# EAGLE design EffectsBox (EAGLE 7.6.0)
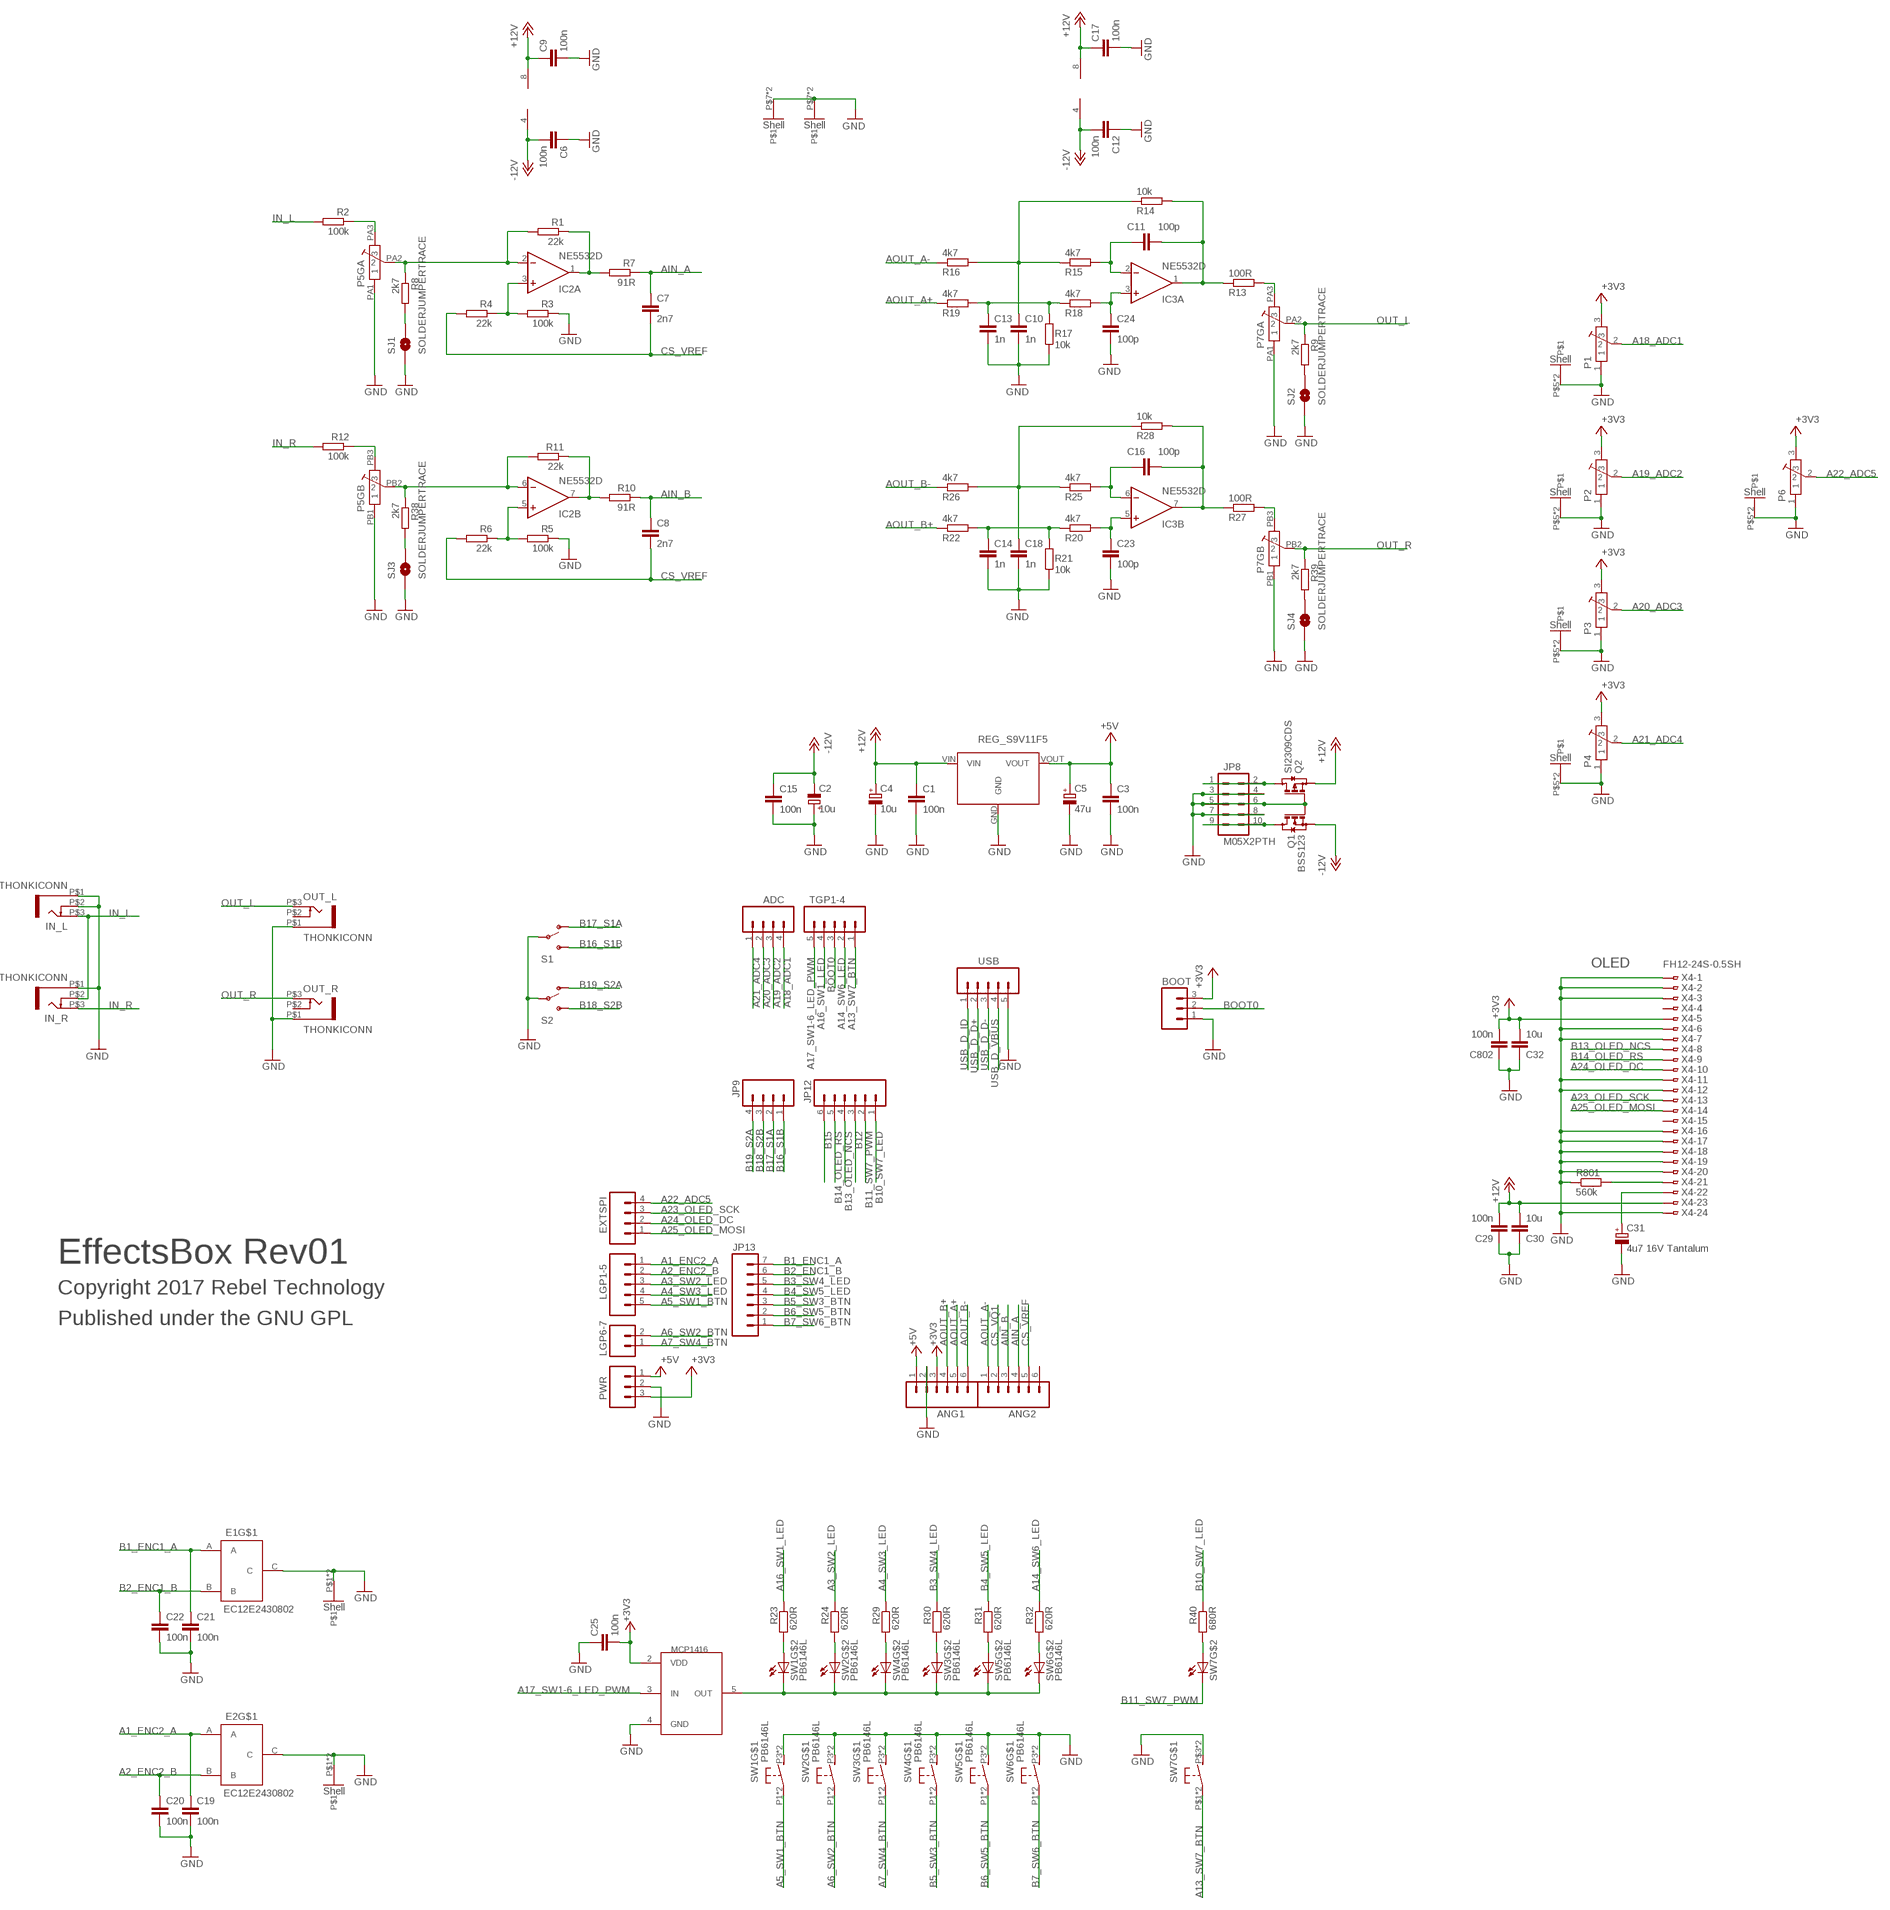
[diagram p0: schematic, sheet 1]

## Parts
ADC  M04PTH  [1X04]
ANG1  M06SIP  [1X06]
ANG2  M06SIP  [1X06]
BOOT  M03PTH  [1X03]
C1  100n  C-EUC0603  [C0603]
C2  10u  CPOL-EU153CLV-0505  [CPOL-5]
C3  100n  C-EUC0603  [C0603]
C4  10u  CPOL-EU153CLV-0505  [CPOL-5]
C5  47u  CPOL-EUC  [PANASONIC_C]
C6  100n  C-EUC0603  [C0603]
C7  2n7  C-EUC0603  [C0603]
C8  2n7  C-EUC0603  [C0603]
C9  100n  C-EUC0603  [C0603]
C10  1n  C-EUC0603  [C0603]
C11  100p  C-EUC0603  [C0603]
C12  100n  C-EUC0603  [C0603]
C13  1n  C-EUC0603  [C0603]
C14  1n  C-EUC0603  [C0603]
C15  100n  C-EUC0603  [C0603]
C16  100p  C-EUC0603  [C0603]
C17  100n  C-EUC0603  [C0603]
C18  1n  C-EUC0603  [C0603]
C19  100n  C-EUC0603  [C0603]
C20  100n  C-EUC0603  [C0603]
C21  100n  C-EUC0603  [C0603]
C22  100n  C-EUC0603  [C0603]
C23  100p  C-EUC0603  [C0603]
C24  100p  C-EUC0603  [C0603]
C25  100n  C-EUC0603  [C0603]
C29  100n  C-EUC0603  [C0603]
C30  10u  C-EUC1206  [C1206]
C31  4u7 16V Tantalum  CPOL-EUSMCA  [SMC_A]
C32  10u  C-EUC1206  [C1206]
C802  100n  C-EUC0603  [C0603]
E1  EC12E2430802  [EC12E2430802]
E2  EC12E2430802  [EC12E2430802]
EXTSPI  M04PTH  [1X04]
IC2  NE5532D  [SO08]
IC3  NE5532D  [SO08]
IN_L  THONKICONN  [THONKICONN]
IN_R  THONKICONN  [THONKICONN]
JP8  M05X2PTH  [AVR_ICSP]
JP9  M04PTH  [1X04]
JP12  M06SIP  [1X06]
JP13  M07  [1X07]
LGP1-5  M05PTH  [1X05]
LGP6-7  M02PTH  [1X02]
OUT_L  THONKICONN  [THONKICONN]
OUT_R  THONKICONN  [THONKICONN]
P1  POT-ALPS-RK09L1140  [POT-ALPS-RK09L1140]
P2  POT-ALPS-RK09L1140  [POT-ALPS-RK09L1140]
P3  POT-ALPS-RK09L1140  [POT-ALPS-RK09L1140]
P4  POT-ALPS-RK09L1140  [POT-ALPS-RK09L1140]
P5  POT-ALPS_RK09L12D0A1W  [POT-ALPS-RK09L12D0A1W]
P6  POT-ALPS-RK09L1140  [POT-ALPS-RK09L1140]
P7  POT-ALPS_RK09L12D0A1W  [POT-ALPS-RK09L12D0A1W]
PWR  M03PTH  [1X03]
Q1  BSS123  [SOT23]
Q2  SI2309CDS  BSS84  [SOT23]
R1  22k  R-EU_0603  [0603]
R2  100k  R-EU_0603  [0603]
R3  100k  R-EU_0603  [0603]
R4  22k  R-EU_0603  [0603]
R5  100k  R-EU_0603  [0603]
R6  22k  R-EU_0603  [0603]
R7  91R  R-EU_0603  [0603]
R8  2k7  R-EU_R0603  [R0603]
R9  2k7  R-EU_R0603  [R0603]
R10  91R  R-EU_0603  [0603]
R11  22k  R-EU_0603  [0603]
R12  100k  R-EU_0603  [0603]
R13  100R  R-EU_0603  [0603]
R14  10k  R-EU_0603  [0603]
R15  4k7  R-EU_0603  [0603]
R16  4k7  R-EU_0603  [0603]
R17  10k  R-EU_0603  [0603]
R18  4k7  R-EU_0603  [0603]
R19  4k7  R-EU_0603  [0603]
R20  4k7  R-EU_0603  [0603]
R21  10k  R-EU_0603  [0603]
R22  4k7  R-EU_0603  [0603]
R23  620R  R-EU_0603  [0603]
R24  620R  R-EU_0603  [0603]
R25  4k7  R-EU_0603  [0603]
R26  4k7  R-EU_0603  [0603]
R27  100R  R-EU_0603  [0603]
R28  10k  R-EU_0603  [0603]
R29  620R  R-EU_0603  [0603]
R30  620R  R-EU_0603  [0603]
R31  620R  R-EU_0603  [0603]
R32  620R  R-EU_0603  [0603]
R38  2k7  R-EU_R0603  [R0603]
R39  2k7  R-EU_R0603  [R0603]
R40  680R  R-EU_0603  [0603]
R801  560k  R-EU_0603  [0603]
S1  SWITCH-SPST  [SWITCH-SPDT-SALECOM-T8014]
S2  SWITCH-SPST  [SWITCH-SPDT-SALECOM-T8014]
SJ1  SOLDERJUMPERTRACE  [SJ_2S-TRACE]
SJ2  SOLDERJUMPERTRACE  [SJ_2S-TRACE]
SJ3  SOLDERJUMPERTRACE  [SJ_2S-TRACE]
SJ4  SOLDERJUMPERTRACE  [SJ_2S-TRACE]
SW1  PB6146L  [PB6146L]
SW2  PB6146L  [PB6146L]
SW3  PB6146L  [PB6146L]
SW4  PB6146L  [PB6146L]
SW5  PB6146L  [PB6146L]
SW6  PB6146L  [PB6146L]
SW7  KS01-BL  [KS01-BL]
TGP1-4  M05PTH  [1X05]
U1  REG_S9V11F5  [REG_S9V11F5]
U2  MCP1416  [SOT23-5]
USB  M05PTH  [1X05]
X4  FH12-24S-0.5SH  [FH12-24S-0.5SH]

## Nets
+3V3: ANG1.3 BOOT.3 C25.2 C32.2 C802.2 P1.3 P2.3 P3.3 P4.3 P6.3 PWR.3 U2.2(VDD) X4.5
+5V: ANG1.1 C3.1 C5.+ PWR.1 U1.VOUT
+12V: C1.1 C4.+ C9.1 C17.1 C29.2 C30.2 IC2.8(P:V+) IC3.8(P:V+) Q2.2(S) U1.VIN X4.23
-12V: C2.- C6.2 C12.2 C15.1 IC2.4(P:V-) IC3.4(P:V-) Q1.2(S)
A1_ENC2_A: C19.1 E2.A LGP1-5.1
A2_ENC2_B: C20.1 E2.B LGP1-5.2
A3_SW2_LED: LGP1-5.3 R24.1
A4_SW3_LED: LGP1-5.4 R29.1
A5_SW1_BTN: LGP1-5.5 SW1.P1(P) SW1.P2(P)
A6_SW2_BTN: LGP6-7.2 SW2.P1(P) SW2.P2(P)
A7_SW4_BTN: LGP6-7.1 SW3.P1(P) SW3.P2(P)
A13_SW7_BTN: SW7.P$1(P) SW7.P$2(P) TGP1-4.1
A14_SW6_LED: R32.1 TGP1-4.2
A16_SW1_LED: R23.1 TGP1-4.4
A17_SW1-6_LED_PWM: TGP1-4.5 U2.3(IN)
A18_ADC1: ADC.4 P1.2
A19_ADC2: ADC.3 P2.2
A20_ADC3: ADC.2 P3.2
A21_ADC4: ADC.1 P4.2
A22_ADC5: EXTSPI.4 P6.2
A23_OLED_SCK: EXTSPI.3 X4.13
A24_OLED_DC: EXTSPI.2 X4.10
A25_OLED_MOSI: EXTSPI.1 X4.14
AIN_A: ANG2.4 C7.1 R7.1
AIN_B: ANG2.3 C8.1 R10.1
AOUT_A+: ANG1.5 R19.1
AOUT_A-: ANG2.1 R16.1
AOUT_B+: ANG1.4 R22.1
AOUT_B-: ANG1.6 R26.1
B1_ENC1_A: C21.1 E1.A JP13.7
B2_ENC1_B: C22.1 E1.B JP13.6
B3_SW4_LED: JP13.5 R30.1
B4_SW5_LED: JP13.4 R31.1
B5_SW3_BTN: JP13.3 SW4.P1(P) SW4.P2(P)
B6_SW5_BTN: JP13.2 SW5.P1(P) SW5.P2(P)
B7_SW6_BTN: JP13.1 SW6.P1(P) SW6.P2(P)
B10_SW7_LED: JP12.1 R40.1
B11_SW7_PWM: JP12.2 SW7.P$C(C)
B12: JP12.3
B13_OLED_NCS: JP12.4 X4.8
B14_OLED_RS: JP12.5 X4.9
B15: JP12.6
B16_S1B: JP9.1 S1.3(S)
B17_S1A: JP9.2 S1.1(O)
B18_S2B: JP9.3 S2.3(S)
B19_S2A: JP9.4 S2.1(O)
BOOT0: BOOT.2 TGP1-4.3
CS_VQ1: ANG2.2
CS_VREF: ANG2.5 C7.2 C8.2 R4.2 R6.2
GND: ANG1.2 BOOT.1 C1.2 C2.+ C3.2 C4.- C5.- C6.1 C9.2 C10.2 C12.1 C13.2 C14.2 C15.2 C17.2 C18.2 C19.2 C20.2 C21.2 C22.2 C23.1 C24.1 C25.1 C29.1 C30.1 C31.- C32.1 C802.1 E1.C E1.P$1 E1.P$2 E2.C E2.P$1 E2.P$2 IN_L.P$1 IN_L.P$2 IN_R.P$1 JP8.3 JP8.4 JP8.5 JP8.6 JP8.7 JP8.8 OUT_L.P$1 OUT_R.P$1 P1.1 P1.P$5 P1.P$6 P2.1 P2.P$5 P2.P$6 P3.1 P3.P$5 P3.P$6 P4.1 P4.P$5 P4.P$6 P5.P$7 P5.P$8 P5.PA1 P5.PB1 P6.1 P6.P$5 P6.P$6 P7.P$7 P7.P$8 P7.PA1 P7.PB1 PWR.2 Q1.1(G) Q2.1(G) R3.1 R5.1 R17.1 R21.1 R801.1 S1.2(P) S2.2(P) SJ1.1 SJ2.1 SJ3.1 SJ4.1 SW1.P3(S) SW1.P4(S) SW2.P3(S) SW2.P4(S) SW3.P3(S) SW3.P4(S) SW4.P3(S) SW4.P4(S) SW5.P3(S) SW5.P4(S) SW6.P3(S) SW6.P4(S) SW7.P$3(S) SW7.P$4(S) U1.GND U2.4(GND) USB.5 X4.1 X4.2 X4.3 X4.6 X4.7 X4.11 X4.12 X4.16 X4.17 X4.18 X4.19 X4.20 X4.24
IN_L: IN_L.P$3 IN_R.P$2 R2.2
IN_R: IN_R.P$3 R12.2
N$1: IC2.1(A:OUT) R1.1 R7.2
N$2: IC2.3(A:+IN) R3.2 R4.1
N$3: P5.PA3 R2.1
N$4: IC2.5(B:+IN) R5.2 R6.1
N$5: C31.+ X4.22
N$6: P7.PA3 R13.2
N$7: C11.1 IC3.2(A:-IN) R15.2
N$8: JP8.9 JP8.10 Q1.3(D)
N$9: IC2.2(A:-IN) P5.PA2 R1.2 R8.1
N$10: IC2.7(B:OUT) R10.2 R11.1
N$11: C24.2 IC3.3(A:+IN) R18.2
N$12: JP8.1 JP8.2 Q2.3(D)
N$13: R9.2 SJ2.2
N$14: SW1.PL2(C) SW2.PL2(C) SW3.PL2(C) SW4.PL2(C) SW5.PL2(C) SW6.PL2(C) U2.5(OUT)
N$15: C13.1 R17.2 R18.1 R19.2
N$16: R23.2 SW1.PL1(A)
N$17: R8.2 SJ1.2
N$18: C16.2 IC3.7(B:OUT) R27.1 R28.2
N$19: R24.2 SW2.PL1(A)
N$20: R29.2 SW4.PL1(A)
N$21: R30.2 SW3.PL1(A)
N$22: R31.2 SW5.PL1(A)
N$23: R32.2 SW6.PL1(A)
N$24: C18.1 R25.1 R26.2 R28.1
N$25: R801.2 X4.21
N$26: C16.1 IC3.6(B:-IN) R25.2
N$30: C23.2 IC3.5(B:+IN) R20.2
N$31: IC2.6(B:-IN) P5.PB2 R11.2 R38.1
N$32: C14.1 R20.1 R21.2 R22.2
N$33: P5.PB3 R12.1
N$34: R38.2 SJ3.2
N$35: P7.PB3 R27.2
N$36: R39.2 SJ4.2
N$39: C11.2 IC3.1(A:OUT) R13.1 R14.2
N$41: C10.1 R14.1 R15.1 R16.2
OUT_L: OUT_L.P$3 P7.PA2 R9.1
OUT_R: OUT_R.P$3 P7.PB2 R39.1
SW6_LED: R40.2 SW7.P$A(A)
USB_D_D+: USB.2
USB_D_D-: USB.3
USB_D_ID: USB.1
USB_D_VBUS: USB.4
Unconnected: ANG2.6 OUT_L.P$2 OUT_R.P$2 X4.4 X4.15

## Notes on the sheet
- OLED
- EffectsBox Rev01
- Copyright 2017 Rebel Technology
- Published under the GNU GPL

## Library data of the parts
ADC EXTSPI JP9 = SparkFun:M04: Header 4 Standard 4-pin 0.1" header. Use with straight break away headers (SKU : PRT-00116), right angle break away headers (PRT-00553), swiss pins (PRT-00743), machine pins (PRT-00117), and female headers (PRT-00115). Molex polarized connector foot print use with SKU : PRT-08231 with associated crimp pins and housings. 1MM SMD Version SKU: PRT-10208
ANG1 ANG2 JP12 = SparkFun:M06: Header 6 Standard 6-pin 0.1" header. Use with straight break away headers (SKU : PRT-00116), right angle break away headers (PRT-00553), swiss pins (PRT-00743), machine pins (PRT-00117), and female headers (PRT-00115). Molex polarized connector foot print use with SKU : PRT-08094 with associated crimp pins and housings. NOTES ON THE VARIANTS LOCK and LOCK_LONGPADS... This footprint was designed to help hold the alignment of a through-hole component (i.e. 6-pin header) while soldering it into place. You may notice that each hole has been shifted either up or down by 0.005 of an inch from it's more standard position (which is a perfectly straight line). This slight alteration caused the pins (the squares in the middle) to touch the edges of the holes. Because they are alternating, it causes a "brace" to hold the component in place. 0.005 has proven to be the perfect amount of "off-center" position when using our standard breakaway headers. Although looks a little odd when you look at the bare footprint, once you have a header in there, the alteration is very hard to notice. Also, if you push a header all the way into place, it is covered up entirely on the bottom side. This idea of altering the position of holes to aid alignment will be further integrated into the Sparkfun Library for other footprints. It can help hold any component with 3 or more connection pins.
BOOT PWR = SparkFun:M03: Header 3 Standard 3-pin 0.1" header. Use with straight break away headers (SKU : PRT-00116), right angle break away headers (PRT-00553), swiss pins (PRT-00743), machine pins (PRT-00117), and female headers (PRT-00115). Molex polarized connector foot print use with SKU : PRT-08232 with associated crimp pins and housings.
C1 C3 C15 C19-C22 C25 C29 C30 C32 C802 = Rebel:C-EU: CAPACITOR, European symbol
C2 C4 C31 = Rebel:CPOL-EU: POLARIZED CAPACITOR, European symbol
C5 = rcl:CPOL-EU: POLARIZED CAPACITOR, European symbol
C6-C14 C16-C18 C23 C24 = resistor:C-EU: CAPACITOR, European symbol
E1 E2 = Rebel:EC12E2430802: EC12E2430802 rotary encoder without a switch
IC2 IC3 = linear:NE5532: AUDIO AMPLIFIER
IN_L IN_R OUT_L OUT_R = Rebel:THONKICONN
JP8 = SparkFun:M05X2: Header 5x2 Standard 10-pin dual row 0.1" header. Commonly used with AVR-ISP. Use with Spark Fun Electronics SKU: PRT-00778
JP13 = SparkFun:M07: Header 7 Standard 7-pin 0.1" header. Use with straight break away headers (SKU : PRT-00116), right angle break away headers (PRT-00553), swiss pins (PRT-00743), machine pins (PRT-00117), and female headers (PRT-00115). NOTES ON THE VARIANTS LOCK and LOCK_LONGPADS... This footprint was designed to help hold the alignment of a through-hole component (i.e. 7-pin header) while soldering it into place. You may notice that each hole has been shifted either up or down by 0.005 of an inch from it's more standard position (which is usually a perfectly straight line). This slight alteration caused the pins (the squares in the middle) to touch the edges of the holes. Because they are alternating, it causes a "brace" to hold the header in place. 0.005 has proven to be the perfect amount of "off-center" position when using our standard breakaway headers. Although looks a little odd when you look at the bare footprint, once you have a header in there, the alteration is very hard to notice. Also, if you push a header all the way into place, it is covered up entirely on the bottom side. This idea of altering the position of holes to aid alignment will be further integrated into the Sparkfun Library for other footprints. It can help hold any component with 3 or more connection pins.
LGP1-5 TGP1-4 USB = SparkFun:M05: Header 5 Standard 5-pin 0.1" header. Use with straight break away headers (SKU : PRT-00116), right angle break away headers (PRT-00553), swiss pins (PRT-00743), machine pins (PRT-00117), and female headers (PRT-00115). Molex polarized connector foot print use with SKU : PRT-08230 with associated crimp pins and housings.
LGP6-7 = SparkFun:M02: Header 2 Standard 2-pin 0.1" header. Use with straight break away headers (SKU : PRT-00116), right angle break away headers (PRT-00553), swiss pins (PRT-00743), machine pins (PRT-00117), and female headers (PRT-00115). Molex polarized connector foot print use with SKU : PRT-08233 with associated crimp pins and housings.
P1-P4 P6 = Rebel:POT-ALPS-RK09L
P5 P7 = Rebel:POT-ALPS_RK09L12D0A1W
Q1 = transistor-small-signal:BSS123: N-CHANNEL MOS FET; OC_FARNELL: 1843725
Q2 = transistor-small-signal:BSS84: P-CHANNEL MOS FET; OC_FARNELL: 1779264
R1-R7 R10-R32 R40 R801 = Rebel:R-EU_: RESISTOR, European symbol
R8 R9 R38 R39 = resistor:R-EU_: RESISTOR, European symbol
S1 S2 = Rebel:SWITCH-SPST: SPST Switch Simple slide switch. Spark Fun Electronics SKU : COM-00102
SJ1-SJ4 = SparkFun:SOLDERJUMPER: Solder Jumper Standard SMD solder jumper. Used to automate production. Two varients : Normally Open and Normally Closed are the same, but have different paste layers. NC will have a large amount of paste and should jumper during reflow.
SW1-SW6 = Rebel:PB6146L
SW7 = Rebel:KS01-BL: Tactile illuminated pushbutton
U1 = Rebel:REG_S9V11F5
U2 = Rebel:MCP1416
X4 = con-hirose:FH12-24S-0.5S: 0.5mm Pitch Connectors For FPC/FFC Source: Data sheet <http://www.hirose.co.jp/cataloge_hp/e58605370.pdf>; MPN: FH12-24S-0.5SH(55); OC_FARNELL: 1324552; OC_NEWARK: 34M6170

## Net classes
1 power: width 0.178 mm, drill 0.305 mm, clearance 0.178 mm to class 0, clearance 0.178 mm

## Board
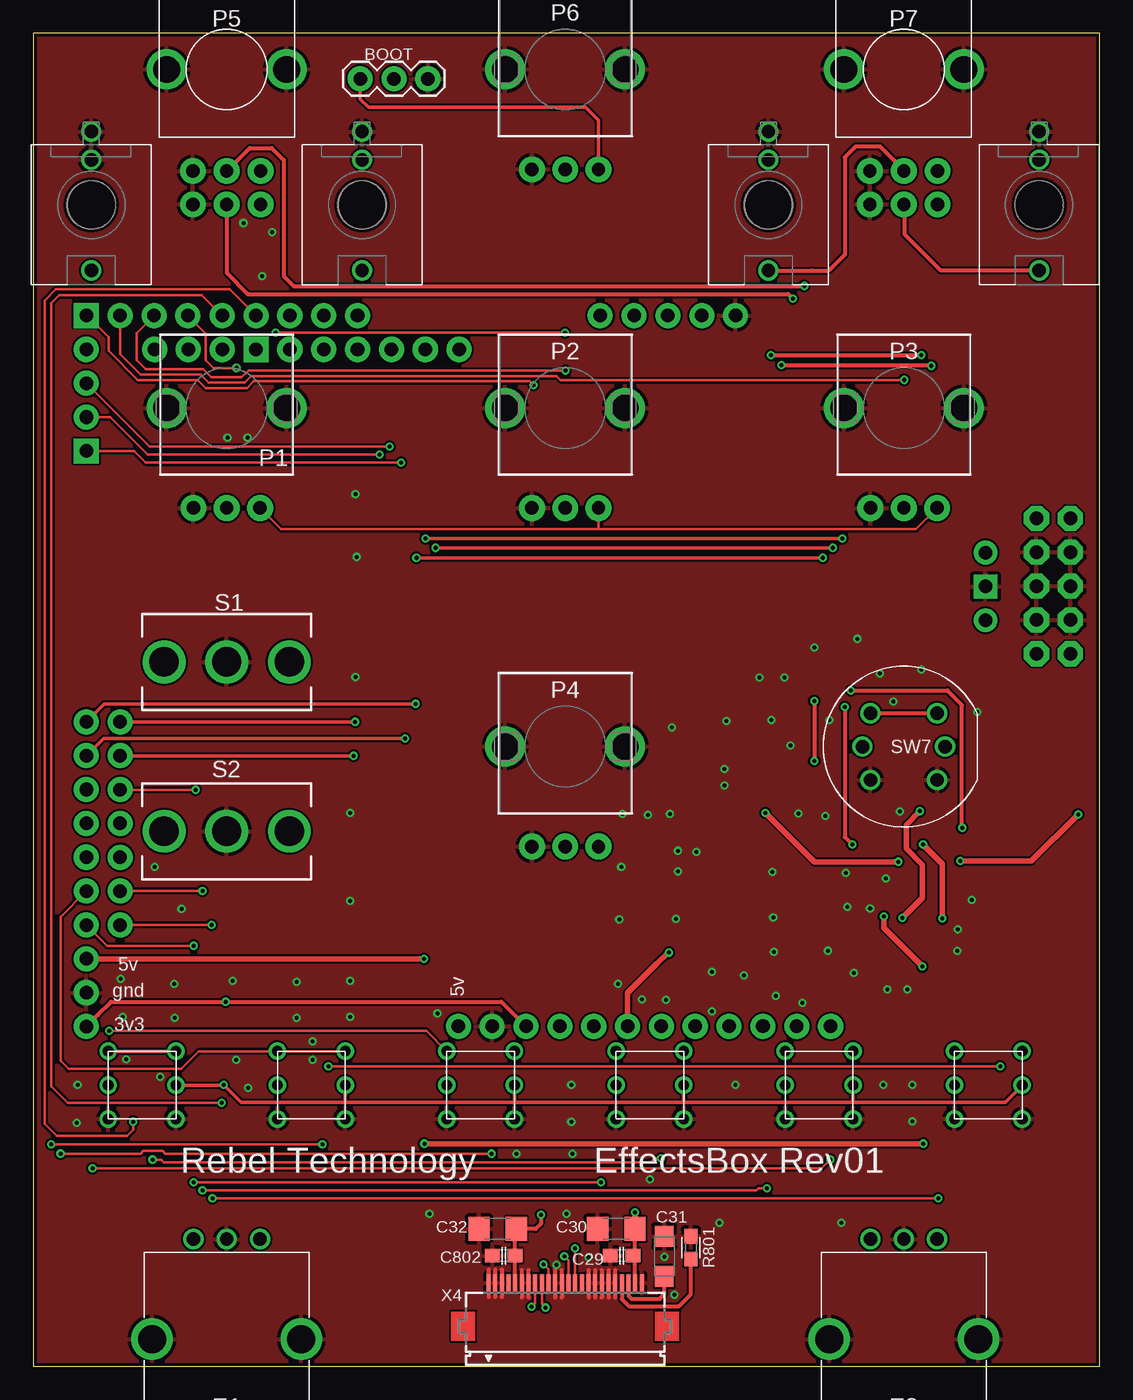
[diagram p1: board, top side]
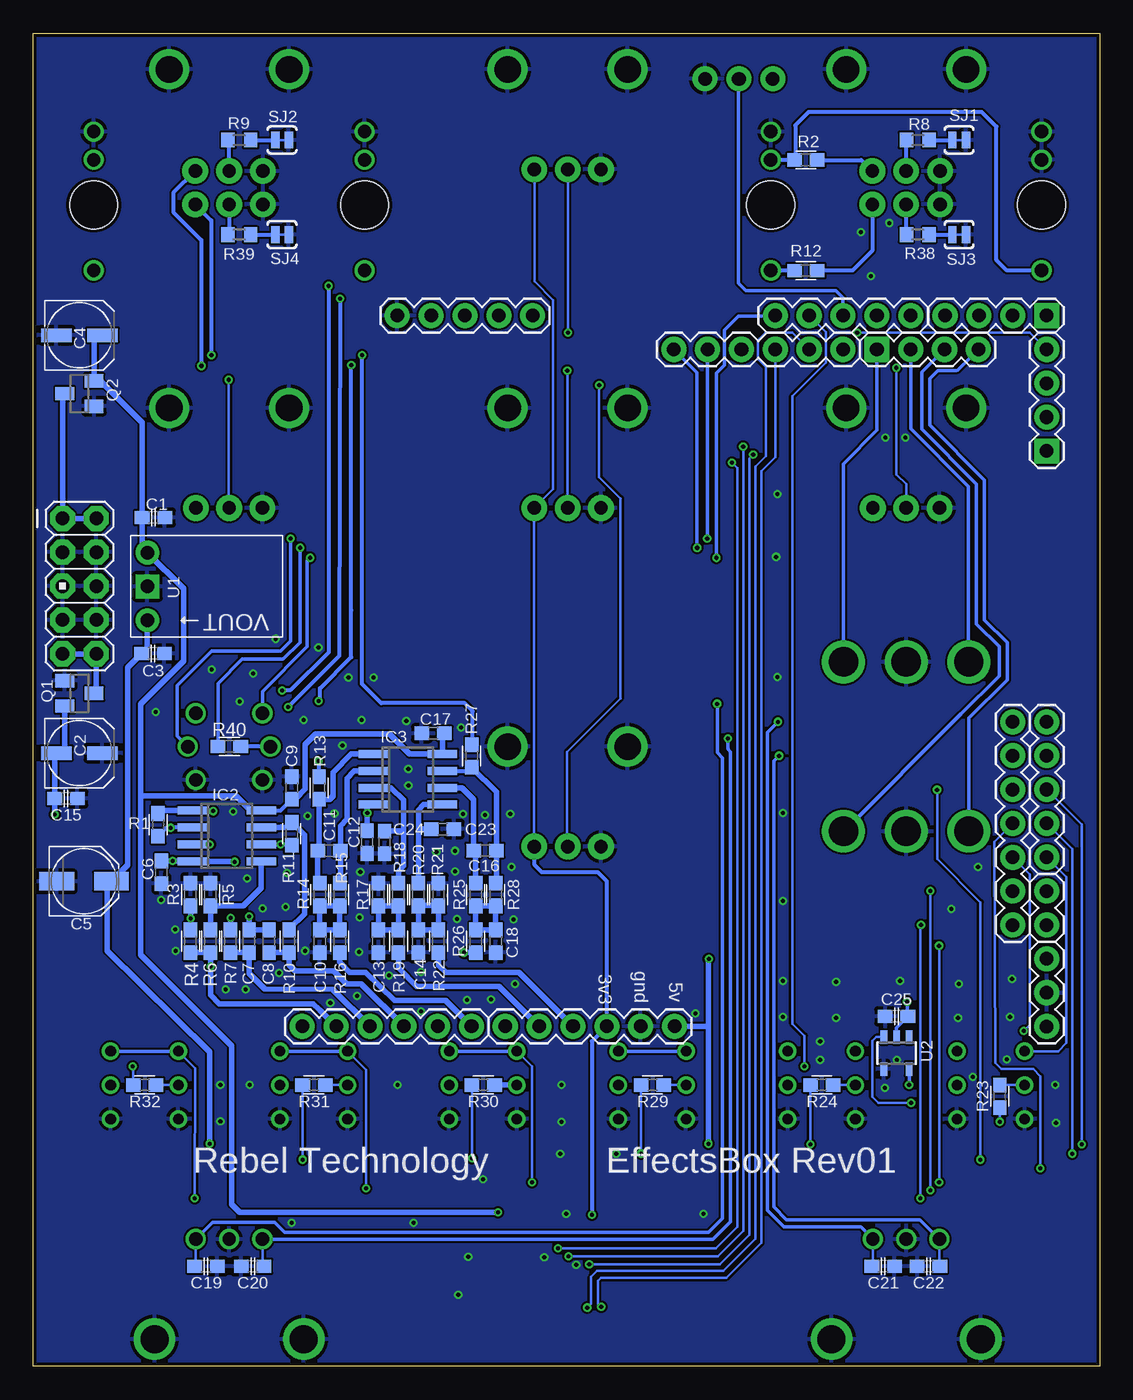
[diagram p2: board, bottom side, seen from below]

Size 80 x 100 mm. Coordinates in mm from the lower left corner, seen from the top.
Outline: 0,0 80,0 80,100 0,100 0,0
Copper layers (1*16): Top 0.035mm / dielectric 1.5mm / Bottom 0.035mm
Design rules "SeeedStudio_2layer_DRU_no_angle_20140221": minimum track width 6mil, minimum drill 12mil, track to track 6mil, track to pad 6mil, pad to pad 6mil, via to via 6mil, smd to smd 0mil, copper to edge 10mil, drill to drill 10mil, minimum pad ring 10mil, minimum via ring 6mil, stop-mask expansion 2mil, vias tented up to drill 100mil, thermal gap 10mil

### Footprints (pad centres in the part's own frame; a part is rotated, then mirrored left to right if it is on the bottom)
1X04 = drill 1.016 pad 1.88 square: 1 0,0 | drill 1.016 pad 1.88: 2 2.54,0; 3 5.08,0; 4 7.62,0
1X06 = drill 1.016 pad 1.88: 1 0,0; 2 2.54,0; 3 5.08,0; 4 7.62,0; 5 10.16,0; 6 12.7,0
1X03 = drill 1.016 pad 1.88: 1 0,0; 2 2.54,0; 3 5.08,0
C0603 = smd 1.1 x 1: 1 -0.85,0; 2 0.85,0
CPOL-5 = smd 2.3 x 1: + 1.725,0; - -1.725,0
PANASONIC_C = smd 2.6 x 1.4: + 2.05,0; - -2.05,0
C1206 = smd 1.6 x 1.8: 1 -1.4,0; 2 1.4,0
SMC_A = smd 1.6 x 1.4: + -1.5,0; - 1.5,0
EC12E2430802 = drill 1: A -2.5,-7.5; B 2.5,-7.5; C 0,-7.5 | drill 2.1: P$1 -5.6,0; P$2 5.6,0
SO08 = smd 0.6 x 2.2: 1 -1.905,-2.6; 2 -0.635,-2.6; 3 0.635,-2.6; 4 1.905,-2.6; 5 1.905,2.6; 6 0.635,2.6; 7 -0.635,2.6; 8 -1.905,2.6
THONKICONN = drill 1: P$1 0,-5.5; P$2 0,-3.38; P$3 0,4.92 | hole 3.6: 0,0
AVR_ICSP = drill 1.016 pad 1.88 octagon: 1 -1.27,5.08; 2 1.27,5.08; 3 -1.27,2.54; 4 1.27,2.54; 5 -1.27,0; 6 1.27,0; 7 -1.27,-2.54; 8 1.27,-2.54; 9 -1.27,-5.08; 10 1.27,-5.08
1X07 = drill 1.016 pad 1.88: 1 0,0; 2 2.54,0; 3 5.08,0; 4 7.62,0; 5 10.16,0; 6 12.7,0; 7 15.24,0
1X05 = drill 1.016 pad 1.88: 1 0,0; 2 2.54,0; 3 5.08,0; 4 7.62,0; 5 10.16,0
1X02 = drill 1.016 pad 1.88: 1 0,0; 2 2.54,0
POT-ALPS-RK09L1140 = drill 1 pad 1.93: 1 -2.5,-7.5; 2 0,-7.5; 3 2.5,-7.5 | drill 2: P$5 -4.5,0; P$6 4.5,0
POT-ALPS-RK09L12D0A1W = drill 2: P$7 4.5,0; P$8 -4.5,0 | drill 1 pad 1.93: PA1 -2.54,-7.62; PA2 0,-7.62; PA3 2.54,-7.62; PB1 -2.54,-10.12; PB2 0,-10.12; PB3 2.54,-10.12
SOT23 = smd 1 x 1.4: 1 -0.95,-1.1; 2 0.95,-1.1; 3 0,1.1
0603 = smd 1.1 x 1: 1 -0.85,0; 2 0.85,0
R0603 = smd 1 x 1.1: 1 -0.85,0; 2 0.85,0
SWITCH-SPDT-SALECOM-T8014 = drill 2.2: 1 0,4.699; 2 0,0; 3 0,-4.699
SJ_2S-TRACE = smd 0.635 x 1.27: 1 -0.508,0; 2 0.508,0
PB6146L = drill 0.8: P1 -2.54,2.54; P2 2.54,2.54; P3 -2.54,-2.54; P4 2.54,-2.54; PL1 -2.54,0; PL2 2.54,0
KS01-BL = drill 1: P$1 -2.5,2.5; P$2 2.5,2.5; P$3 -2.5,-2.5; P$4 2.5,-2.5; P$A -3.1,0; P$C 3.1,0
REG_S9V11F5 = drill 1.016 pad 1.778 square: GND 0,0 | drill 1.016 pad 1.778: VIN -2.54,0; VOUT 2.54,0
SOT23-5 = smd 0.5 x 1: 1 -0.95,-1.2; 2 0,-1.2; 3 0.95,-1.2; 4 0.95,1.2; 5 -0.95,1.2
FH12-24S-0.5SH = smd 0.3 x 1.3: 1 -5.75,3.25; 2 -5.25,3.25; 3 -4.75,3.25; 4 -4.25,3.25; 5 -3.75,3.25; 6 -3.25,3.25; 7 -2.75,3.25; 8 -2.25,3.25; 9 -1.75,3.25; 10 -1.25,3.25; 11 -0.75,3.25; 12 -0.25,3.25; 13 0.25,3.25; 14 0.75,3.25; 15 1.25,3.25; 16 1.75,3.25; 17 2.25,3.25; 18 2.75,3.25; 19 3.25,3.25; 20 3.75,3.25; 21 4.25,3.25; 22 4.75,3.25; 23 5.25,3.25; 24 5.75,3.25

### Placement (x,y rotation side)
ADC  3.97,78.82 180 bottom
ANG1  31.89,25.5 180 bottom
ANG2  47.12,25.5 180 bottom
BOOT  29.6,96.59 180 top
C1  70.98,63.67 0 bottom
C2  76.54,45.99 0 bottom
C3  71.03,53.47 0 bottom
C4  76.54,77.34 0 bottom
C5  76.2,36.38 0 bottom
C6  70.39,37.06 90 bottom
C7  63.81,31.88 90 bottom
C8  62.31,31.88 90 bottom
C9  60.61,43.38 90 bottom
C10  58.51,31.88 270 bottom
C11  57.81,38.68 180 bottom
C12  54.95,39.31 90 bottom
C13  54.11,31.88 270 bottom
C14  51.11,31.88 270 bottom
C15  77.54,42.59 0 bottom
C16  46.11,38.68 0 bottom
C17  50.01,47.48 180 bottom
C18  45.31,31.88 270 bottom
C19  67.04,7.5 0 bottom
C20  63.54,7.5 180 bottom
C21  16.24,7.5 0 bottom
C22  12.84,7.5 180 bottom
C23  49.29,40.29 180 bottom
C24  53.64,39.29 90 bottom
C25  15.24,26.25 0 bottom
C29  44.14,8.29 0 top
C30  43.74,10.29 0 top
C31  47.34,8.24 90 top
C32  34.84,10.29 0 top
C802  35.29,8.29 0 top
E1  14.51,2.04 180 top
E2  65.31,2.04 180 top
EXTSPI  3.97,68.66 90 bottom
IC2  65.48,39.78 270 bottom
IC3  51.91,44.03 270 bottom
IN_L  4.35,87.12 180 top
IN_R  24.67,87.12 180 top
JP8  76.54,58.52 0 bottom
JP9  16.71,76.28 0 bottom
JP12  31.95,76.28 0 bottom
JP13  6.51,33.1 90 bottom
LGP1-5  3.97,48.34 270 bottom
LGP6-7  3.97,33.1 90 bottom
OUT_L  55.15,87.12 180 top
OUT_R  75.47,87.12 180 top
P1  14.51,71.89 0 top
P2  39.91,71.89 0 top
P3  65.31,71.89 0 top
P4  39.91,46.48 0 top
P5  14.51,97.29 0 top
P6  39.91,97.29 0 top
P7  65.31,97.29 0 top
PWR  3.97,30.56 270 bottom
Q1  76.54,50.47 270 bottom
Q2  76.54,72.97 90 bottom
R1  70.64,40.62 270 bottom
R2  22.04,90.5 180 bottom
R3  68.21,35.38 270 bottom
R4  68.21,31.88 270 bottom
R5  66.71,35.38 270 bottom
R6  66.71,31.88 270 bottom
R7  65.21,31.88 90 bottom
R8  13.64,92 0 bottom
R9  64.54,92 0 bottom
R10  60.81,31.88 90 bottom
R11  60.61,39.94 270 bottom
R12  22.04,82.2 180 bottom
R13  58.56,43.38 90 bottom
R14  58.51,35.38 90 bottom
R15  57.01,35.38 90 bottom
R16  57.01,31.88 90 bottom
R17  54.11,35.38 270 bottom
R18  52.61,35.38 90 bottom
R19  52.61,31.88 90 bottom
R20  51.11,35.38 90 bottom
R21  49.61,35.38 270 bottom
R22  49.61,31.88 90 bottom
R23  7.49,20.25 90 bottom
R24  20.84,21.1 0 bottom
R25  46.81,35.38 90 bottom
R26  46.81,31.88 90 bottom
R27  47.11,45.78 90 bottom
R28  45.31,35.38 90 bottom
R29  33.54,21.1 0 bottom
R30  46.24,21.1 0 bottom
R31  58.94,21.1 0 bottom
R32  71.64,21.1 0 bottom
R38  13.64,84.9 0 bottom
R39  64.54,84.9 0 bottom
R40  65.29,46.49 0 bottom
R801  49.34,8.89 270 top
S1  14.51,52.84 90 top
S2  14.51,40.13 90 top
SJ1  10.54,92 180 bottom
SJ2  61.34,92 180 bottom
SJ3  10.54,84.9 180 bottom
SJ4  61.34,84.9 180 bottom
SW1  8.16,21.09 0 top
SW2  20.86,21.09 0 top
SW3  46.26,21.09 0 top
SW4  33.56,21.09 0 top
SW5  58.96,21.09 0 top
SW6  71.66,21.09 0 top
SW7  65.31,46.48 0 top
TGP1-4  24.33,78.82 0 bottom
U1  71.44,58.49 270 bottom
U2  15.24,23.5 180 bottom
USB  42.53,78.82 180 bottom
X4  39.91,3 0 top

### Tracks (layer width: path | path; a pad name or v marks a point on that pad's centre or on a via)
+3V3  (via drill 0.3)
  Top 0.204: P1.3 18.6,62.79 42.44,62.79 | 42.44,62.79 66.22,62.79 P3.3 | P2.3 42.41,62.82 42.44,62.79
  Top 0.254: BOOT.3 24.52,95.06 25.14,94.45 41.44,94.45 42.41,93.48 P6.3
  Top 0.305: PWR.3 3.98,25.5 4.84,26.35 5.84,27.35 v14.44,27.35 35.12,27.35 ANG1.3 | X4.5 36.16,8.34 | v38.09,11.34 38.09,10.69 37.69,10.29 C32.2 36.16,10.21 36.16,8.34 | C802.2 36.14,8.32 36.16,8.34
  Top 0.406: 36.97,25.57 ANG1.3
  Bottom 0.204: P4.3 42.44,39.02 42.44,64.36 P2.3 40.99,65.81 40.99,80 42.41,81.42 P6.3
  Bottom 0.254: v14.44,27.35 14.44,26.25 C25.2 15.24,25.39 U2.2
  Bottom 0.305: P4.3 42.39,38.96 42.39,37.59 41.84,37.04 37.64,37.04 36.97,36.38 ANG1.3 38.09,24.38 v38.09,11.34
+5V  (via drill 0.3)
  Top 0.406: v66.78,16.7 v29.34,16.7 | PWR.1 v29.32,30.56
  Bottom 0.305: v29.32,30.56 29.34,30.55
  Bottom 0.406: v66.78,16.7 66.78,23.57 74.44,31.16 74.44,36.09 C5.+ 72.93,37.59 72.93,52.41 C3.1 71.44,53.9 U1.VOUT | v29.34,16.7 29.34,25.5 | 29.34,25.5 ANG1.1 | 29.34,25.5 29.34,30.55
+12V  (via drill 0.3)
  Top 0.305: X4.23 45.16,8.19 | 45.16,8.19 45.16,8.69 C30.2 | C29.2 44.99,8.19 45.16,8.19
  Top 0.406: C30.2 v45.14,11.54
  Bottom 0.305: 62.94,41.74 IC2.8 61.45,41.68 C9.1
  Bottom 0.406: 62.46,41.68 IC2.8 62.58,41.68 | C9.1 60.38,42.53 59.59,43.31 59.59,46.65 58.81,47.43 53.28,47.43 51.78,45.93 IC3.8 49.31,47.33 C17.1 | 75.44,77.34 Q2.2 74.96,73.92 71.83,70.79 C1.1 71.83,61.42 U1.VIN 68.74,58.33 68.74,52.89 71.94,49.69 71.94,42.79 | 75.44,77.34 75.54,77.34 | 75.44,77.34 C4.+ | 71.94,42.79 64.79,42.79 63.74,41.74 62.94,41.74 | 71.94,42.79 71.94,30.87 65.12,24.05 65.12,12.14 64.52,11.54 v45.14,11.54
-12V  (via drill 0.3)
  Top 0.406: v54.94,41.49 58.59,37.84 v64.89,37.84 | v69.54,37.89 74.89,37.89 v78.39,41.39
  Bottom 0.406: IC3.4 54.94,42.12 54.94,41.89 54.96,41.47 C12.2 54.95,41.48 v54.94,41.49 | Q1.2 77.64,45.99 C2.- 78.39,45.99 C15.1 v78.39,41.39 | v64.89,37.84 64.92,37.88 IC2.4 68.31,37.89 C6.2 70.38,37.89 v69.54,37.89
A1_ENC2_A  (via drill 0.3)
  Top 0.254: LGP1-5.1 5.32,49.7 v28.69,49.7
  Bottom 0.204: E2.A 67.81,7.58 C19.1
  Bottom 0.254: E2.A 66.55,10.79 61.89,10.79 61.14,10.04 29.34,10.04 28.29,11.09 28.29,45.64 28.69,46.04 v28.69,49.7
A2_ENC2_B  (via drill 0.3)
  Top 0.254: v27.89,47.09 5.26,47.09 LGP1-5.2
  Bottom 0.204: E2.B 62.81,7.61 C20.1
  Bottom 0.254: E2.B 29,9.53 27.69,10.84 27.69,46.09 27.89,46.29 v27.89,47.09
A3_SW2_LED  (via drill 0.3)
  Top 0.204: v1.34,16.64 v21.69,16.64
  Bottom 0.204: LGP1-5.3 1.34,40.63 v1.34,16.64 | v21.69,16.64 R24.1
A4_SW3_LED  (via drill 0.3)
  Top 0.204: v2.04,15.94 8.04,15.94 8.24,16.14 9.69,16.14 9.89,15.94 v34.39,15.94
  Bottom 0.204: R29.1 v34.39,15.94 | LGP1-5.4 2.04,38.79 v2.04,15.94
A5_SW1_BTN
  Top 0.254: SW1.P1 SW1.P2
  Bottom 0.204: LGP1-5.5 2.49,36.7 2.49,24.25 3.11,23.62 SW1.P1
A6_SW2_BTN
  Top 0.204: LGP6-7.2 2.04,33.71 2.04,22.89 2.64,22.3 11.09,22.3 12.42,23.62 SW2.P1 SW2.P2
A7_SW4_BTN  (via drill 0.3)
  Top 0.204: v42.59,13.79 v12.04,13.79 | v12.04,31.54 5.53,31.54 LGP6-7.1
  Bottom 0.204: SW3.P1 42.59,22.5 v42.59,13.79 | v12.04,13.79 v12.04,31.54
  Bottom 0.254: SW3.P2 SW3.P1
A13_SW7_BTN  (via drill 0.3)
  Top 0.254: v59.24,60.64 v28.74,60.64
  Top 0.305: SW7.P$2 SW7.P$1
  Bottom 0.254: SW7.P$1 62.81,50.62 59.44,53.99 59.44,60.45 v59.24,60.64 | v28.74,60.64 28.74,74.5 28.14,75.09 28.14,77.75 27.09,78.8 24.36,78.8 TGP1-4.1
A14_SW6_LED  (via drill 0.3)
  Top 0.204: v72.54,22.5 v22.14,22.5
  Bottom 0.204: R32.1 72.49,22.35 v72.54,22.5 | v22.14,22.5 22.14,24.8 23.04,25.7 23.04,72.8 20.54,75.3 20.54,77.57 TGP1-4.2
A16_SW1_LED  (via drill 0.3)
  Top 0.204: v7.49,18.35 7.49,17.75 7.04,17.3 1.74,17.3 0.84,18.2 0.84,79.95 1.69,80.8 14.74,80.8 TGP1-4.4
  Bottom 0.204: R23.1 v7.49,18.35
A17_SW1-6_LED_PWM  (via drill 0.3)
  Top 0.204: v14.14,19.75 2.59,19.75 1.34,21 1.34,79.75 1.94,80.34 12.65,80.34 TGP1-4.5
  Bottom 0.204: v14.14,19.75 16.59,19.75 17.04,20.2 17.04,24.39 16.74,24.7 U2.3
A18_ADC1  (via drill 0.3)
  Top 0.204: ADC.4 12.94,77.48 12.94,75.5 13.54,74.9 v15.24,74.9
  Bottom 0.204: P1.2 14.51,66.17 15.24,66.9 v15.24,74.9
A19_ADC2  (via drill 0.3)
  Top 0.204: ADC.3 7.74,77.51 7.74,75.5 8.44,74.8 12.74,74.8 13.34,74.2 15.64,74.2 16.14,74.7 v39.94,74.7
  Bottom 0.204: P2.2 39.91,74.17 v39.94,74.7
A20_ADC3  (via drill 0.3)
  Top 0.204: ADC.2 6.51,75.92 8.04,74.4 12.54,74.4 13.14,73.8 15.84,73.8 16.34,74.3 39.24,74.3 39.54,74 v65.34,74
  Bottom 0.204: v65.34,74 65.34,64.42 P3.2
A21_ADC4  (via drill 0.3)
  Top 0.204: ADC.1 4.01,78.82 5.64,77.2 5.64,76.2 7.84,74 12.34,74 12.94,73.4 16.04,73.4 16.54,73.9 37.24,73.9 v37.54,73.59
  Bottom 0.204: v37.54,73.59 37.54,66.7 35.94,65.09 35.94,50.09 39.94,46.09 39.94,39.02 P4.2
A22_ADC5  (via drill 0.3)
  Top 0.204: v18.19,77.55 v39.89,77.55
  Bottom 0.204: EXTSPI.4 5.24,77.55 v18.19,77.55 | v39.89,77.55 39.89,89.77 P6.2
A23_OLED_SCK  (via drill 0.3)
  Top 0.204: EXTSPI.3 8.72,69 v26.74,69 | X4.13 40.16,7.92 v39.84,8.24
  Bottom 0.204: v39.84,8.24 28.64,8.24 26.74,10.14 v26.74,69
A24_OLED_DC  (via drill 0.3)
  Top 0.204: EXTSPI.2 5.78,71.2 8.59,68.4 v25.99,68.4 | X4.10 38.66,7.28 v38.29,7.65
  Bottom 0.204: v38.29,7.65 28.49,7.65 26.29,9.84 26.29,68.09 v25.99,68.4
A25_OLED_MOSI  (via drill 0.3)
  Top 0.204: EXTSPI.1 7.57,68.66 8.44,67.8 v27.59,67.8 | X4.14 40.66,8.56 v40.64,8.84
  Bottom 0.204: v40.64,8.84 28.79,8.84 27.19,10.44 27.19,67.4 v27.59,67.8
AIN_A
  Bottom 0.406: C7.1 R7.1 | 63.74,30.96 arc-90 C7.1 | C7.1 63.81,29.48 62.63,28.3 57.55,28.26 ANG2.4
AIN_B
  Bottom 0.406: C8.1 R10.1 60.81,30.11 60.34,29.64 59.45,29.64 59.44,29.66 57.45,29.66 56.49,28.7 55.4,28.7 ANG2.3
AOUT_A+
  Bottom 0.406: ANG1.5 45.05,28.5 51.24,28.5 52.61,29.86 R19.1
AOUT_A-
  Bottom 0.406: R16.1 57.01,30.31 56.25,29.56 55.05,29.56 52.89,27.45 49.07,27.45 ANG2.1
AOUT_B+
  Bottom 0.406: R22.1 49.61,30.08 49.05,29.53 43.54,29.53 ANG1.4 39.54,25.53
AOUT_B-  (via drill 0.3)
  Top 0.406: ANG1.6 44.59,28.01 46.81,30.23 47.64,31.03 v47.7,31.03
  Bottom 0.406: 46.96,31.03 R26.1 v47.7,31.03
B1_ENC1_A  (via drill 0.3)
  Top 0.254: v24.14,48.34 JP13.7 arc90 JP13.7
  Bottom 0.204: E1.A 17.01,7.58 C21.1
  Bottom 0.254: E1.A 17.92,10.44 23.69,10.44 24.94,11.69 24.94,47.54 v24.14,48.34
B2_ENC1_B  (via drill 0.3)
  Top 0.254: v24.04,45.79 JP13.6
  Bottom 0.204: E1.B 12.01,7.51 C22.1
  Bottom 0.254: E1.B 13.47,10.99 23.49,10.99 24.44,11.94 24.44,45.39 v24.04,45.79
B3_SW4_LED  (via drill 0.3)
  Top 0.204: v8.94,15.49 9.59,15.49 9.79,15.29 46.29,15.29 46.59,15.6 v47.09,15.6 | v12.19,43.24 6.53,43.24 JP13.5
  Bottom 0.204: R30.1 v47.09,15.6 | v8.94,15.49 8.94,34.79 12.19,38.04 v12.19,43.24
B4_SW5_LED  (via drill 0.3)
  Top 0.204: v59.79,15.49 59.14,14.84 v4.44,14.84
  Bottom 0.204: R31.1 v59.79,15.49 | JP13.4 7.89,39.34 7.84,22.75 7.39,22.3 4.99,22.3 4.44,21.75 v4.44,14.84
B5_SW3_BTN  (via drill 0.3)
  Top 0.204: SW4.P1 29.49,25.14 v5.69,25.14
  Bottom 0.204: JP13.3 5.24,36.91 5.24,25.6 v5.69,25.14
  Bottom 0.254: SW4.P2 SW4.P1
B6_SW5_BTN  (via drill 0.3)
  Top 0.204: v12.69,13.19 54.24,13.19 54.39,13.34 v55.04,13.34 | v12.69,35.64 JP13.2
  Bottom 0.204: SW5.P1 55.04,22.25 v55.04,13.34 | v12.69,13.19 v12.69,35.64
  Bottom 0.254: SW5.P2 SW5.P1
B7_SW6_BTN  (via drill 0.3)
  Top 0.204: v67.89,12.59 v13.44,12.59 | v13.39,33.09 JP13.1
  Bottom 0.204: SW6.P1 67.84,22.35 v67.89,12.59 | v13.44,12.59 13.44,33.04 v13.39,33.09
  Bottom 0.254: SW6.P2 SW6.P1
B10_SW7_LED  (via drill 0.3)
  Top 0.254: v59.99,61.39 v30.19,61.39
  Bottom 0.254: R40.1 66.14,51.22 64.32,53.04 61.24,53.04 59.99,54.29 v59.99,61.39 | v30.19,61.39 30.19,74.52 JP12.1
B11_SW7_PWM  (via drill 0.3)
  Top 0.254: v29.44,62.09 v60.69,62.09
  Bottom 0.254: JP12.2 29.41,62.27 v29.44,62.09 | v60.69,62.09 60.69,54.39 61.44,53.64 66.6,53.64 69.19,51.06 69.19,47.27 SW7.P$C
B13_OLED_NCS  (via drill 0.3)
  Top 0.204: X4.8 37.66,4.71 v37.39,4.45
  Bottom 0.204: v37.39,4.45 37.64,4.7 37.64,6.4 37.39,6.65 27.99,6.65 25.39,9.24 25.39,67.15 24.33,68.2 JP12.4
B14_OLED_RS  (via drill 0.3)
  Top 0.204: X4.9 38.16,4.67 v38.44,4.4
  Bottom 0.204: v38.44,4.4 38.14,4.7 38.14,6.7 37.69,7.15 28.24,7.15 25.84,9.54 25.84,67.5 25.04,68.3 25.04,74.95 25.64,75.55 25.64,77 25.09,77.55 23.05,77.55 JP12.5 21.8,76.28
B16_S1B
  Bottom 0.254: JP9.1 16.71,70.23 19.24,67.7 19.24,52.87
  Bottom 0.406: 19.24,52.87 S1.3
B17_S1A
  Bottom 0.254: JP9.2 14.17,70.33 9.84,66 9.84,52.39 9.74,52.29 9.74,52.76 S1.1
B18_S2B
  Bottom 0.254: JP9.3 11.65,76.28 13.34,74.59 13.34,70.3 9.24,66.2 9.24,55.7 7.54,53.99 7.54,51.79 10.44,48.89 | 19.24,40.17 S2.3
  Bottom 0.305: S2.3 10.44,48.89
B19_S2A
  Bottom 0.254: S2.1 9.81,48.62 6.94,51.49 6.94,54.29 8.64,55.99 8.64,66.5 12.74,70.59 12.74,74.09 12.14,74.7 10.74,74.7 10.64,74.73 JP9.4
BOOT0
  Bottom 0.254: TGP1-4.3 19.25,80.16 19.79,80.7 26.54,80.7 27.09,81.25 27.09,96.51 BOOT.2
CS_VREF  (via drill 0.3)
  Top 0.406: v66.71,29.98 63.81,32.88 v63.81,33.73
  Bottom 0.406: C8.2 C7.2 v63.81,33.73 | R4.2 R6.2 v66.71,29.98 66.71,27.86 66.04,27.2 58.99,27.2 58.53,26.73 ANG2.5
GND  (via drill 0.3)
  Top 0.305: X4.20 43.66,5.15 | 43.16,6.29 43.16,5.15 | X4.18 42.66,5.15 | X4.17 42.16,5.15 | 43.66,7.2 43.66,6.09 | 43.16,7.2 43.16,6.09 | 42.66,7.2 42.66,6.09 | 42.16,7.2 42.16,6.09 | 41.66,7.2 41.66,5.15 | 39.66,5.15 X4.12 39.66,7.2 | 39.16,7.2 39.16,5.15 | 35.16,7.25 35.16,5.2 | 34.66,7.25 34.66,5.2 | 34.16,7.25 34.16,5.2 | 36.66,5.15 X4.6 36.66,7.2 | 37.16,6.29 37.16,7.2 | 37.16,5.15 37.16,6.2
  other vias: 62.78,34.34 63.97,36.58 59.61,31.17 55.56,31.07 47.76,41.42 48.36,37.12 48.36,38.67 55.51,33.67 55.46,37.07 61.06,34.47 59.41,41.27 57.41,41.47 56.81,46.57 51.87,43.57 51.87,44.82 46.12,41.37 49.77,38.57 60.96,37.02 48.21,33.57 65.57,28.27 61.56,29.52 55.71,27.77 50.91,26.62 43.96,33.52 44.12,37.47 44.21,41.42 52.02,48.42 55.37,48.47 59.71,48.47 47.91,47.92 65.02,41.62 70.42,34.97 69.32,31.17 69.37,32.77 53.31,29.32 6.71,26.22 10.61,26.12 19.77,26.12 19.77,28.82 14.96,28.92 20.96,24.37 20.96,22.97 6.96,23.02 10.57,28.67 6.57,29.07 11.11,34.32 9.11,37.47 15.77,85.77 17.16,81.77 17.91,85.07 64.52,49.87 16.11,20.87 15.21,22.97 3.31,21.12 3.27,18.27 30.31,26.47 9.52,21.72 58.62,53.92 54.46,51.67 61.81,54.57 16.07,69.67 63.77,21.12 65.97,21.12 52.66,21.12 40.37,21.12 24.16,51.72 24.27,60.72 24.16,65.42 23.77,28.92 23.77,26.22 23.77,34.92 23.77,41.52 40.37,18.32 40.46,15.92 36.27,15.92 46.27,14.02 56.37,51.67 66.62,52.27 63.52,51.97 70.82,49.07 50.91,29.57 45.66,27.52 47.46,27.47 43.87,28.67 57.71,27.27 64.06,28.27 14.57,69.67 65.97,18.37 60.62,10.77 51.46,10.77 47.37,8.22 41.66,8.17 48.12,5.37 39.27,7.62 29.71,11.42 40.02,11.42
  pour Bottom: -2,-6.85 -2,101.09 83.09,101.09 83.09,-6.85
  pour Top: -2,-9.4 -2,101.09 83.09,101.09 83.09,-9.4
IN_L
  Bottom 0.305: IN_R.P$2 R2.2 22.84,90.55 22.84,93.09 21.84,94.09 8.84,94.09 7.74,93 7.74,83 6.95,82.2 IN_L.P$3
IN_R
  Bottom 0.305: R12.2 IN_R.P$3
N$1  (via drill 0.3)
  Top 0.406: v66.51,41.64 65.49,40.62 65.49,38.84 66.69,37.59 66.69,35.11 v65.21,33.63
  Bottom 0.406: v66.51,41.64 68.03,41.64 IC2.1 70.51,41.68 R1.1 | R7.2 v65.21,33.63
N$2  (via drill 0.3)
  Top 0.406: v68.21,33.58 68.21,37.69 v66.76,39.14
  Bottom 0.406: R3.2 v68.21,33.58 R4.1 | v66.76,39.14 IC2.3
N$3
  Bottom 0.305: R2.1 17.88,90.5 P5.PA3
N$4
  Bottom 0.406: R6.1 R5.2 64.26,34.53 62.91,35.88 62.91,37.84 IC2.5
N$5
  Top 0.305: X4.22 44.66,5.28 44.89,5.04 46.99,5.04 47.34,5.45 C31.+
N$6  (via drill 0.3)
  Top 0.305: v58.59,49.89 v58.59,45.39 | v56.14,75.09 67.19,75.09 arc-90 v67.39,75.05
  Bottom 0.305: P7.PA3 69.49,88.03 69.49,86.59 67.39,84.5 v67.39,75.05 | v58.59,49.89 58.49,49.79 58.49,50.84 56.14,53.2 56.14,56.7 56.14,56.69 56.14,75.07 56.14,75.08 v56.14,75.09 | v58.59,45.39 58.59,44.26 R13.2
N$7
  Bottom 0.406: R15.2 56.96,36.23 C11.1 56.96,40.54 56.44,41.06 56.44,44.09 55.92,44.66 IC3.2
N$8
  Bottom 0.406: 77.71,53.45 JP8.9 JP8.10 75.27,50.47 Q1.3
N$9  (via drill 0.3)
  Top 0.305: P5.PA2 16.24,91.4 17.89,91.4 18.79,90.5 18.79,81.8 19.54,81.05 v57.84,81.05 | v61.34,50.7 68.59,50.7 69.68,49.6 69.68,40.41 69.69,40.41 v69.69,40.39
  Bottom 0.305: P5.PA2 14.51,91.98 R8.1 | v57.84,81.05 57.84,53.54 60.74,50.7 v61.34,50.7 | IC2.2 69.67,40.41 v69.69,40.39 70.02,40.39 R1.2
N$10
  Bottom 0.406: IC2.7 61.41,40.41 | 61.41,40.41 60.98,40.41 R11.1 59.66,39.84 59.66,33.94 60.81,32.79 R10.2 | 61.41,40.44 61.41,40.41
N$11
  Bottom 0.406: R18.2 52.61,37.13 52.23,37.51 52.23,40.04 | 52.23,40.04 52.23,42.46 53.16,43.39 IC3.3 | C24.2 52.32,40.14 52.23,40.04
N$12
  Bottom 0.406: 77.69,72.97 Q2.3 77.81,72.97 JP8.1 JP8.2
N$13
  Bottom 0.305: R9.2 SJ2.2
N$14  (via drill 0.3)
  Top 0.254: 36.09,21.12 SW4.PL2 36.1,19.8 | SW3.PL2 48.79,21.14 48.79,19.8 | 61.49,21.25 SW5.PL2 61.5,19.94 arc90 61.64,19.8 | SW6.PL2 72.91,19.8 61.64,19.8 | 61.64,19.8 48.79,19.8 | 48.79,19.8 36.1,19.8 | 36.1,19.8 23.39,19.8 | 23.39,19.8 SW2.PL2 | 23.39,19.8 15.59,19.8 v14.29,21.1 13.88,21.09 SW1.PL2
  Bottom 0.254: U2.5 v14.29,21.1
N$15
  Bottom 0.406: R19.2 C13.1 R17.2 R18.1 52.61,32.78
N$16
  Bottom 0.204: SW1.PL1 R23.2
N$17
  Bottom 0.305: R8.2 SJ1.2
N$18
  Bottom 0.305: IC3.7 47.09,44.66 R27.1
  Bottom 0.406: R28.2 45.26,36.28 C16.2 45.26,43.08 R27.1
N$19
  Bottom 0.204: R24.2 SW2.PL1
N$20
  Bottom 0.204: R29.2 SW4.PL1
N$21
  Bottom 0.204: SW3.PL1
  Bottom 0.406: R30.2 SW3.PL1
N$22
  Bottom 0.204: R31.2 SW5.PL1
N$23
  Bottom 0.204: R32.2 SW6.PL1
N$24
  Bottom 0.406: C18.1 R26.2 R25.1 R28.1 45.31,32.78
N$25
  Top 0.305: X4.21 44.16,5.03 44.69,4.5 48.44,4.5 49.34,5.4 R801.2
N$26
  Bottom 0.406: IC3.6 47.84,43.39 46.96,42.51 C16.1 arc90 46.81,38.53 R25.2
N$30
  Bottom 0.406: R20.2 51.11,40.31 | 50.11,42.13 50.11,42.03 50.21,42.03 50.31,42.13 | 50.31,42.13 50.71,42.13 51.11,41.73 51.11,40.31 | 50.31,42.13 IC3.5 | 51.11,40.31 C23.2
N$31  (via drill 0.3)
  Top 0.305: P5.PB2 14.51,82.03 16.09,80.45 56.64,80.45 v56.99,80.09 | v60.89,49.45 60.89,39.7 v61.44,39.14
  Bottom 0.305: IC2.6 v61.44,39.14 60.66,39.14 | v56.99,80.09 57.04,53.29 v60.89,49.45 | R38.1 14.49,87.15 arc-90 P5.PB2
  Bottom 0.406: 60.66,39.14 R11.2
N$32
  Bottom 0.406: R21.2 R22.2 C14.1 R20.1 50.96,34.53 50.91,34.58 | 51.11,34.58 50.91,34.58 | 50.91,34.58 49.61,34.58
N$33
  Bottom 0.305: P5.PB3 17.05,83.69 18.54,82.2 R12.1
N$34
  Bottom 0.305: R38.2 SJ3.2
N$35  (via drill 0.3)
  Top 0.305: v55.34,75.84 v66.64,75.84
  Bottom 0.305: P7.PB3 66.64,85.95 v66.64,75.84 | 47.04,46.29 47.04,46.31 | 47.04,46.31 R27.2 | 47.04,46.31 47.04,49.14 47.64,49.74 53.89,49.74 55.34,51.2 v55.34,75.84
N$36
  Bottom 0.305: R39.2 SJ4.2
N$39
  Bottom 0.406: R14.2 58.66,36.23 C11.2 58.56,38.78 R13.1 57.76,42.53 57.49,42.79 57.49,44.54 56.14,45.95 IC3.1
N$41
  Bottom 0.406: R16.2 C10.1 58.41,32.83 58.51,32.83 R14.1 R15.1 | 57.01,34.58 R15.1 | 57.01,32.78 R15.1
OUT_L
  Top 0.305: P7.PA2 65.31,89.73 63.54,91.5 61.69,91.5 60.89,90.7 60.89,83.4 59.69,82.2 58.43,82.2 OUT_L.P$3
  Bottom 0.305: P7.PA2 65.31,91.92 R9.1
OUT_R
  Top 0.305: OUT_R.P$3 68.08,82.2 R39.1 65.39,87.09 P7.PB2
  Bottom 0.305: OUT_R.P$3 | P7.PB2 65.31,84.98 R39.1
SW6_LED
  Bottom 0.305: SW7.P$A R40.2

### Text on the board
tPlace: 5v | 5v | gnd | 3v3 | Rebel Technology | EffectsBox Rev01
bPlace: 5v | gnd | 3v3 | EffectsBox Rev01 | Rebel Technology